# EAGLE design osu_macropad (EAGLE 9.6.2)
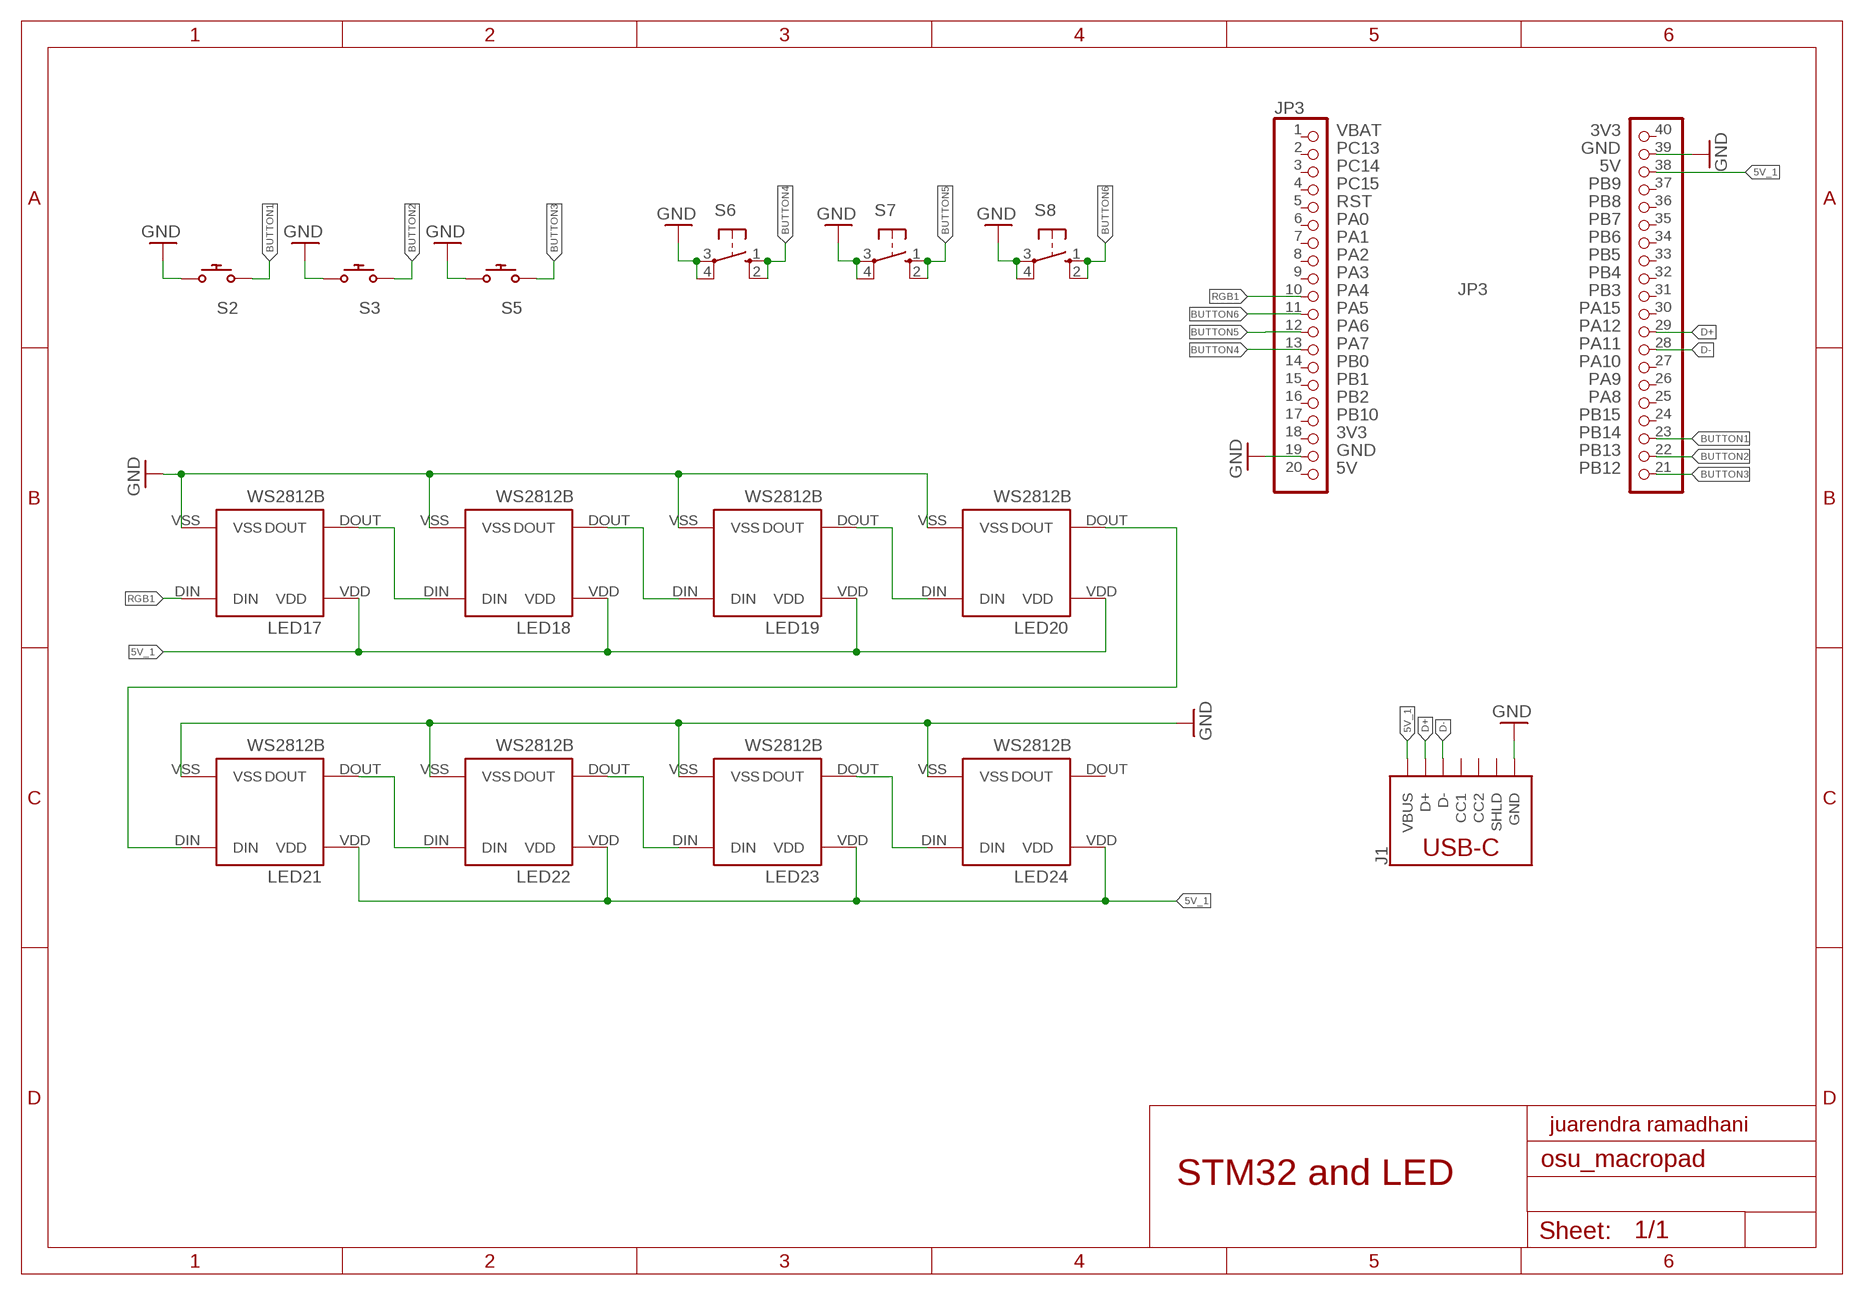
[diagram p0: schematic, sheet 1]

## Parts
J1  USB_C_2-LAYER_PADS  [USB-C-16P-2LAYER-PADS]
JP3  PINHD-1X20  [1X20]
LED17  WS2812B  [WS2812B]
LED18  WS2812B  [WS2812B]
LED19  WS2812B  [WS2812B]
LED20  WS2812B  [WS2812B]
LED21  WS2812B  [WS2812B]
LED22  WS2812B  [WS2812B]
LED23  WS2812B  [WS2812B]
LED24  WS2812B  [WS2812B]
S2  CHERRY_MX_WITH_KEILWITH_KEIL  [CHERRY_MX_WITH_KEIL]
S3  CHERRY_MX_WITH_KEILWITH_KEIL  [CHERRY_MX_WITH_KEIL]
S5  CHERRY_MX_WITH_KEILWITH_KEIL  [CHERRY_MX_WITH_KEIL]
S6  10-XX  [B3F-10XX]
S7  10-XX  [B3F-10XX]
S8  10-XX  [B3F-10XX]

## Nets
5V_1: J1.VBUS1(VBUS) J1.VBUS2(VBUS) JP3.38 LED17.VDD LED18.VDD LED19.VDD LED20.VDD LED21.VDD LED22.VDD LED23.VDD LED24.VDD
BUTTON1: JP3.23 S2.2 S2.4
BUTTON2: JP3.22 S3.2 S3.4
BUTTON3: JP3.21 S5.2 S5.4
BUTTON4: JP3.13 S6.1(S) S6.2(S1)
BUTTON5: JP3.12 S7.1(S) S7.2(S1)
BUTTON6: JP3.11 S8.1(S) S8.2(S1)
D+: J1.A6(D+) J1.B6(D+) JP3.29
D-: J1.A7(D-) J1.B7(D-) JP3.28
GND: J1.GND J1.GND2(GND) JP3.19 JP3.39 LED17.VSS LED18.VSS LED19.VSS LED20.VSS LED21.VSS LED22.VSS LED23.VSS LED24.VSS S2.1 S2.3 S3.1 S3.3 S5.1 S5.3 S6.3(P) S6.4(P1) S7.3(P) S7.4(P1) S8.3(P) S8.4(P1)
N$36: LED19.DOUT LED20.DIN
N$37: LED17.DOUT LED18.DIN
N$38: LED20.DOUT LED21.DIN
N$40: LED18.DOUT LED19.DIN
N$41: LED21.DOUT LED22.DIN
N$42: LED22.DOUT LED23.DIN
N$43: LED23.DOUT LED24.DIN
RGB1: JP3.10 LED17.DIN
Unconnected: J1.A5(CC1) J1.B5(CC2) J1.SHLD1(SHLD) J1.SHLD2(SHLD) J1.SHLD3(SHLD) J1.SHLD4(SHLD) JP3.1 JP3.2 JP3.3 JP3.4 JP3.5 JP3.6 JP3.7 JP3.8 JP3.9 JP3.14 JP3.15 JP3.16 JP3.17 JP3.18 JP3.20 JP3.24 JP3.25 JP3.26 JP3.27 JP3.30 JP3.31 JP3.32 JP3.33 JP3.34 JP3.35 JP3.36 JP3.37 JP3.40 LED24.DOUT

## Notes on the sheet
- juarendra ramadhani
- STM32 and LED

## Library data of the parts
J1 = SparkFun-Connectors:USB_C: USB Type C 16Pin Connector Super Speed pins not available on the 16-pin purely SMD connector so this part is best for USB 2.0 implementations. D1 and D2 are tied together enabling D+/- no matter which way the cable is plugged into the connector. The two channel configuration pins (CC1/2) are exposed. These are normally connected to ground via 5.1k resistors but can be reconfigured for high current/high power applications. **4-LAYER BOARD WARNING!!** If designing 4-layer board, make sure to select the variant _4-LAYER-ISOLATED. The linked footprint (USB-C-16-4LAYER-ISOLATED) includes some very necessary cutout polygons in the inner layers (2 and 15). This prevents the PTH mounting shield legs on the USB connector from electrically connecting any other polygons on the inner layers (usually VCC and GND).; PROD_ID: CONN-14122
JP3 = cherry:PINHD-1X20: PIN HEADER
LED17-LED24 = bt_opto:WS2812B: WS2812B Intelligent Control LED WS2812B is a intelligent control LED light source that the control circuit and RGB chip are integrated in a package of 5050 components. It internal include intelligent digital port data latch and signal reshaping amplification drive circuit. Also include a precision internal oscillator and a 12V voltage programmable constant current control part, effectively ensuring the pixel point light color height consistent. Datasheet.pdf <http://www.mikrocontroller.net/attachment/180459/WS2812B_preliminary.pdf>
S2 S3 S5 = cherry:CHERRY_MX_WITH_KEIL: Cherry keymodule MX
S6-S8 = switch-omron:10-XX: OMRON SWITCH; MPN: B3F-1000; OC_FARNELL: 176432; OC_NEWARK: 36M3542

## Board
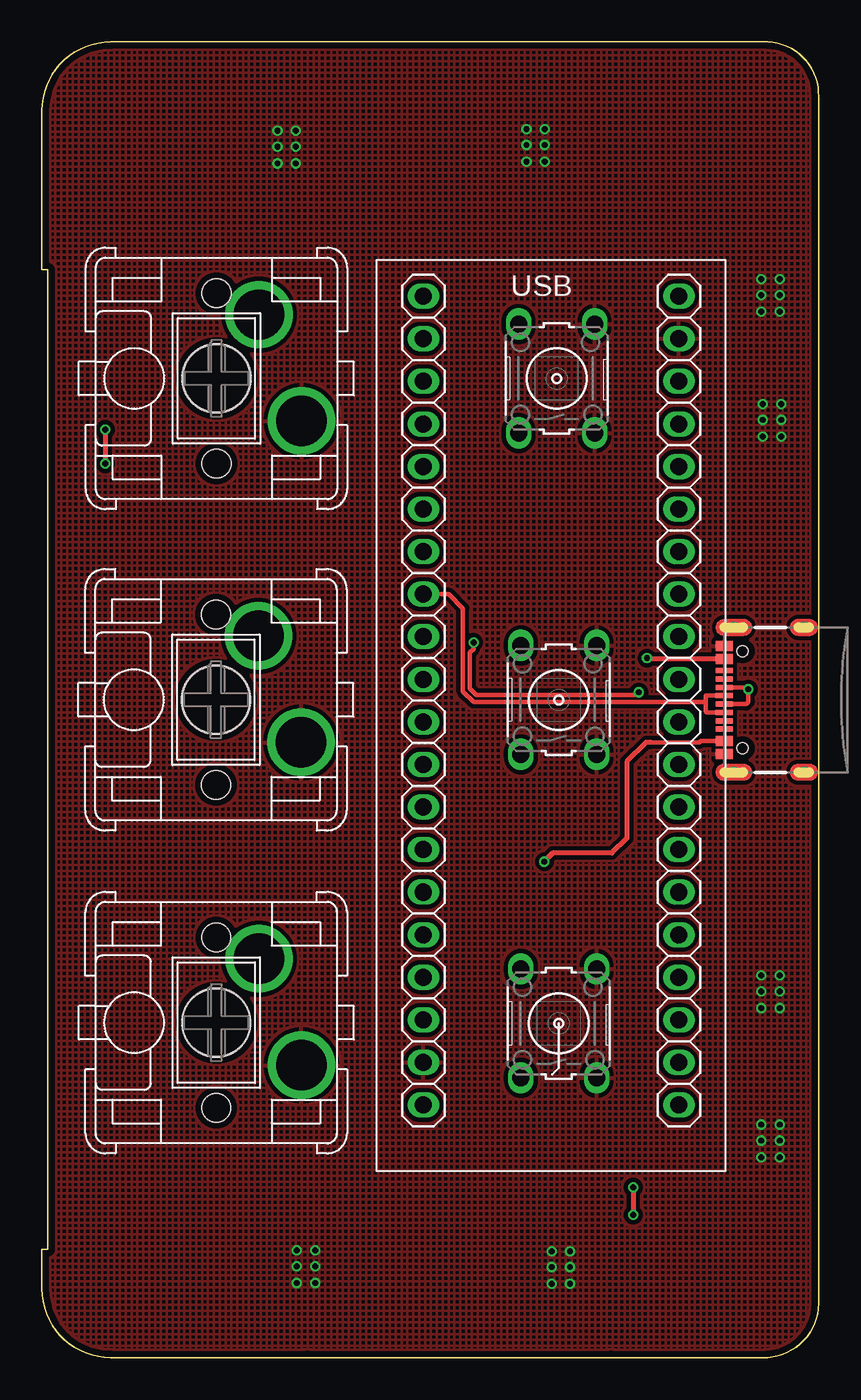
[diagram p1: board, top side]
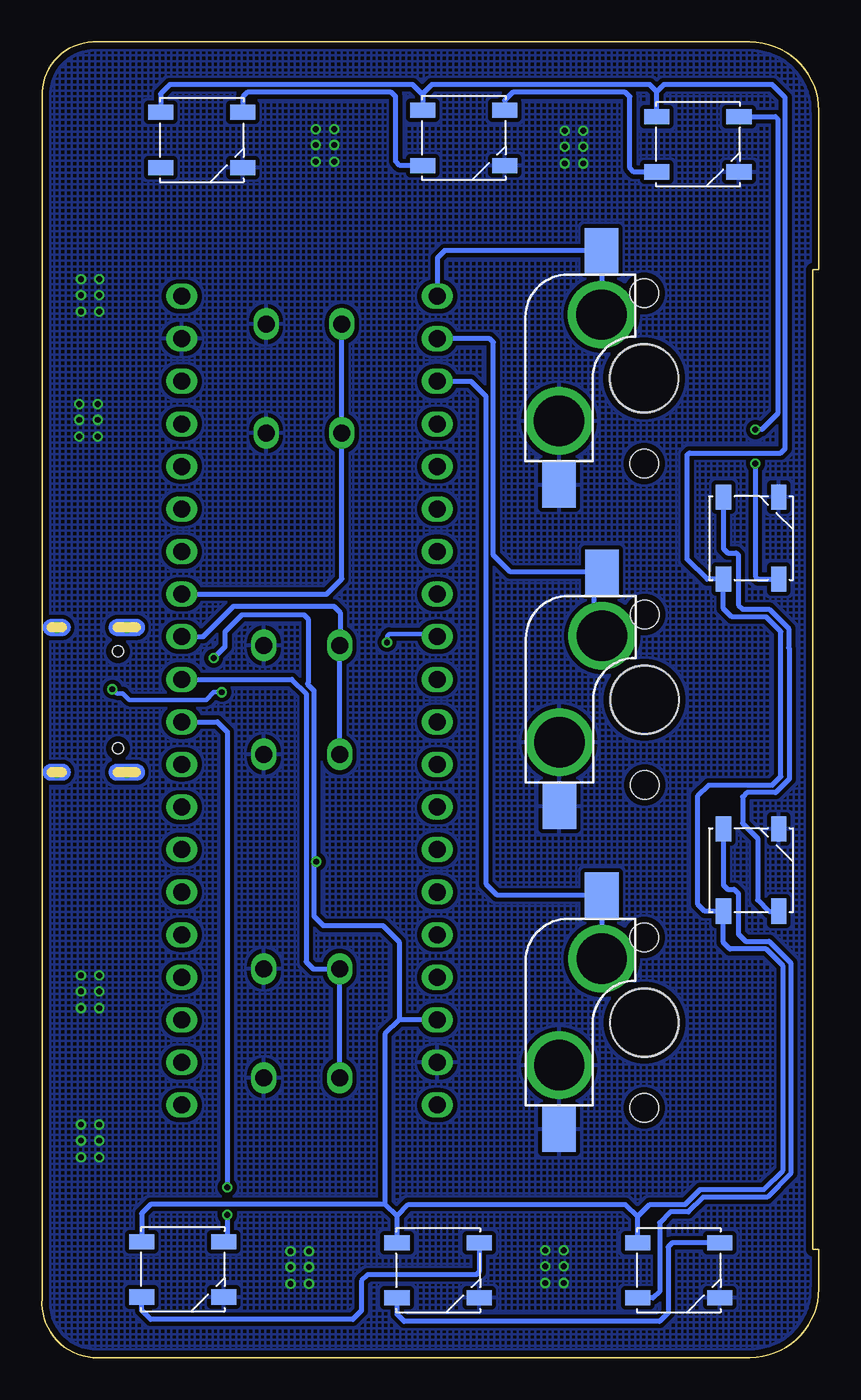
[diagram p2: board, bottom side, seen from below]

Size 46.33 x 78.5 mm. Coordinates in mm from the lower left corner, seen from the top.
Outline: 15.85,0 33.95,0
Outline: 43.3,0 arc90 46.32,3.53 46.32,75.23 arc90 43.3,78.5 4.1,78.5 arc90 0,74.4 0,64.9 0.35,64.9 0.35,6.45 0,6.45 0,4.1 arc90 4.1,0 43.3,0
Copper layers (1*16): Top 0.035559375mm / dielectric 1.6mm / Bottom 0.035559375mm
Design rules "oshpark-2layer *": minimum track width 6mil, minimum drill 10mil, track to track 6mil, track to pad 6mil, pad to pad 25mil, via to via 25mil, smd to smd 6mil, copper to edge 15mil, drill to drill 6mil, minimum pad ring 5mil, minimum via ring 5mil, stop-mask expansion 2.5mil, vias tented up to drill 0.36mm, thermal gap 10mil

### Footprints (pad centres in the part's own frame; a part is rotated, then mirrored left to right if it is on the bottom)
USB-C-16P-2LAYER-PADS = smd 0.3 x 1: A5 -1.25,-0.34; A6 -0.25,-0.34; A7 0.25,-0.34; A8 1.25,-0.34; B5 1.75,-0.34; B6 0.75,-0.34; B7 -0.75,-0.34; B8 -1.75,-0.34 | smd 0.6 x 1: GND -3.225,-0.34; GND2 3.225,-0.34; VBUS1 -2.45,-0.34; VBUS2 2.45,-0.34 | drill 0.4 pad 0.6 long: SHLD1 -4.318,-0.915; SHLD2 4.318,-0.915; SHLD3 -4.318,-5.095; SHLD4 4.318,-5.095 | hole 0.65: -2.89,-1.445; 2.89,-1.445
1X20 = drill 1.016 long: 1 -24.13,0; 2 -21.59,0; 3 -19.05,0; 4 -16.51,0; 5 -13.97,0; 6 -11.43,0; 7 -8.89,0; 8 -6.35,0; 9 -3.81,0; 10 -1.27,0; 11 1.27,0; 12 3.81,0; 13 6.35,0; 14 8.89,0; 15 11.43,0; 16 13.97,0; 17 16.51,0; 18 19.05,0; 19 21.59,0; 20 24.13,0; 21 24.13,15.24; 22 21.59,15.24; 23 19.05,15.24; 24 16.51,15.24; 25 13.97,15.24; 26 11.43,15.24; 27 8.89,15.24; 28 6.35,15.24; 29 3.81,15.24; 30 1.27,15.24; 31 -1.27,15.24; 32 -3.81,15.24; 33 -6.35,15.24; 34 -8.89,15.24; 35 -11.43,15.24; 36 -13.97,15.24; 37 -16.51,15.24; 38 -19.05,15.24; 39 -21.59,15.24; 40 -24.13,15.24
WS2812B = smd 1.5 x 0.9: DIN 2.45,1.65; DOUT -2.45,-1.65; VDD -2.45,1.65; VSS 2.45,-1.65
CHERRY_MX_WITH_KEIL = smd 2.7 x 2 bottom: 1 6.355,5.08; 2 -7.625,2.54 | drill 3 pad 3.6: 3 2.54,5.08; 4 -3.81,2.54 | hole 1.7: -5.08,0; 5.08,0; -5.08,0; 5.08,0 | hole 4.1: 0,0 | hole 4: 0,0
B3F-10XX = drill 1.016 long: 1 -3.251,2.261; 2 3.251,2.261; 3 -3.251,-2.261; 4 3.251,-2.261

### Placement (x,y rotation side)
J1  40.35,39.24 90 top
JP3  37.99,39.2 90 top
LED17  37.93,5.26 0 bottom
LED18  22.7,5.21 0 bottom
LED19  8.35,5.21 0 bottom
LED20  4.03,29.08 90 bottom
LED21  4.03,48.9 90 bottom
LED22  7.2,72.39 0 bottom
LED23  21.17,72.77 0 bottom
LED24  36.79,72.64 0 bottom
S2  10.4,19.98 270 top
S3  10.38,39.25 270 top
S5  10.41,58.42 270 top
S6  30.7,58.42 90 top
S7  30.83,39.24 90 top
S8  30.83,19.94 90 top

### Tracks (layer width: path | path; a pad name or v marks a point on that pad's centre or on a via)
5V_1  (via drill 0.35)
  Top 0.254: J1.VBUS1 39.3,36.79 39.21,36.7 36.29,36.7
  Top 0.305: J1.VBUS2 36.12,41.69 v36.09,41.73 | 36.29,36.7 36.03,36.7 34.89,35.56 34.89,30.99 34,30.1 30.47,30.1 v29.96,29.59
  Bottom 0.305: LED18.VDD 25.15,8.42 | LED17.VDD 40.38,8.61 39.84,9.14 25.87,9.14 | 25.15,8.42 25.87,9.14 | 25.15,8.42 25.15,8.47 24.48,9.14 11.52,9.14 10.8,8.42 | LED19.VDD 10.8,8.42 | 10.8,8.42 10.07,9.14 7.97,9.14 7.08,10.03 3.27,10.03 2.12,11.18 2.12,23.37 3.14,24.38 5.3,24.38 5.68,24.77 LED20.VDD 6.79,26.63 7.2,27.05 7.2,33.53 6.57,34.16 2.76,34.16 2.25,34.67 2.25,43.31 3.14,44.2 5.17,44.2 5.68,44.7 LED21.VDD 6.66,46.45 7.84,47.62 7.84,53.85 7.71,53.98 2.25,53.98 2,54.23 2,75.18 2.76,75.95 9.24,75.95 9.65,75.53 | LED22.VDD 9.65,75.53 | 9.65,75.53 10.07,75.95 23.08,75.95 23.62,75.4 | 23.62,75.4 LED23.VDD | 23.62,75.4 23.68,75.4 24.22,75.95 38.7,75.95 39.24,75.4 LED24.VDD | JP3.38 25.03,20.15 | 25.87,9.14 25.87,19.3 25.03,20.15 | v36.09,41.73 35.4,42.42 35.4,43.31 34.38,44.32 30.7,44.32 30.44,44.07 30.44,40.26 30.5,40.2 30.11,39.81 30.11,29.44 | 25.03,20.15 25.03,24.81 26,25.78 29.56,25.78 30.11,26.34 30.11,28.96 30.11,29.44 | v29.96,29.59 30.11,29.44
BUTTON1
  Bottom 0.305: JP3.23 20.75,58.25 19.85,57.35 19.85,28.27 19.19,27.61 S2.2 S2.4 | S2.4 12.94,23.26 12.92,23.24 12.92,23.77 S2.4
BUTTON2
  Bottom 0.305: S3.4 13.43,43.56 13.43,46.37 S3.2 18.39,46.87 19.4,47.88 19.4,60.58 19.61,60.79 JP3.22
BUTTON3
  Bottom 0.305: S5.4 S5.2 22.31,66.05 22.75,65.61 JP3.21
BUTTON4
  Bottom 0.305: JP3.13 29.35,45.55 28.44,46.46 S6.1 S6.2
BUTTON5
  Bottom 0.305: JP3.12 36.71,43.01 34.89,44.83 28.92,44.83 28.54,44.45 28.54,42.55 | 28.54,42.55 28.54,42.52 S7.2 | S7.1 28.56,42.52 28.54,42.55
BUTTON6
  Bottom 0.305: JP3.11 31.42,40.47 30.57,39.62 30.57,23.62 30.14,23.19 S8.2 S8.1
D+  (via drill 0.35)
  Top 0.254: J1.B6 42.01,39.99 v42.13,39.88 42.13,39.12 42.01,38.99 J1.A6 | v25.75,42.67 25.75,42.29 25.52,42.07 25.52,39.91 25.91,39.52 35.14,39.52 35.4,39.52 35.42,39.52 v35.6,39.7
  Bottom 0.254: v25.75,42.67 25.75,43.05 25.62,43.18 22.92,43.18 JP3.29 | v42.13,39.88 41.88,39.62 41.49,39.62 41.11,39.24 36.54,39.24 36.09,39.7 v35.6,39.7
D-
  Top 0.254: J1.A7 39.59,39.49 39.59,39.5 39.59,39.12 | J1.B7 39.66,38.49 39.59,38.56 39.59,39.12 | 39.59,39.12 25.75,39.12 25.11,39.75 25.11,44.7 24.27,45.55 JP3.28
GND  (via drill 0.35)
  other vias: 42.9,11.95 42.9,12.95 42.9,13.9 44,13.9 44,12.95 44,11.95 42.9,20.85 42.9,21.85 42.9,22.8 44,22.8 44,21.85 44,20.85 14.05,71.25 14.05,72.25 14.05,73.2 15.15,73.2 15.15,72.25 15.15,71.25 28.9,71.35 28.9,72.35 28.9,73.3 30,73.3 30,72.35 30,71.35 15.2,4.45 15.2,5.45 15.2,6.4 16.3,6.4 16.3,5.45 16.3,4.45 30.4,4.4 30.4,5.4 30.4,6.35 31.5,6.35 31.5,5.4 31.5,4.4 42.9,62.4 42.9,63.4 42.9,64.35 44,64.35 44,63.4 44,62.4 43,54.95 43,55.95 43,56.9 44.1,56.9 44.1,55.95 44.1,54.95
  pour Top (isolate 0.254, hatched): 0.1,0.09 49.9,0.09 49.9,78.5 0.1,78.5
  pour Bottom (isolate 0.254, hatched): 0.05,0.24 50,0.24 50,79.1 0.05,79.1
N$36
  Bottom 0.305: LED20.DIN 5.68,28.19 5.43,27.94 5.04,27.94 4.79,27.69 4.79,25.27 4.36,24.84 2.95,24.84 1.67,23.56 1.67,10.99 3.08,9.58 6.89,9.58 7.78,8.69 8.85,8.69 9.49,8.05 9.49,3.94 9.87,3.56 LED19.DOUT
N$37
  Bottom 0.305: LED18.DIN 20.25,5.12 20.41,4.95 26.89,4.95 27.27,4.57 27.27,2.79 27.78,2.29 39.84,2.29 40.38,2.82 LED17.DOUT
N$38
  Bottom 0.305: LED21.DIN 5.68,48.26 5.43,48.01 4.92,48.01 4.79,47.88 4.79,44.91 4.54,44.65 2.95,44.65 1.79,43.5 1.79,42.34 1.74,42.29 1.74,34.53 2.57,33.71 4.28,33.71 4.54,33.45 4.54,31.88 3.65,30.99 3.65,27.3 2.98,26.63 LED20.DOUT
N$40
  Bottom 0.305: LED19.DIN 8.73,6.86 8.98,6.6 8.98,2.67 9.49,2.16 24.73,2.16 25.15,2.58 LED18.DOUT
N$41  (via drill 0.35)
  Top 0.305: v3.77,55.37 v3.77,53.34
  Bottom 0.305: LED22.DIN 2.58,74.04 2.45,73.91 2.45,56.31 3.39,55.37 v3.77,55.37 | v3.77,53.34 3.77,46.61 3.61,46.45 LED21.DOUT
N$42
  Bottom 0.305: LED22.DOUT 11.01,70.74 11.27,70.99 11.27,75.23 11.52,75.49 18.25,75.49 18.72,75.02 LED23.DIN
N$43
  Bottom 0.305: LED23.DOUT 24.98,71.12 25.24,71.37 25.24,75.23 25.49,75.49 34.08,75.49 34.34,75.22 LED24.DIN
RGB1  (via drill 0.35)
  Top 0.305: v35.27,10.16 v35.27,8.51
  Bottom 0.305: JP3.10 35.86,37.93 35.27,37.34 v35.27,10.16 | v35.27,8.51 35.27,7.12 LED17.DIN